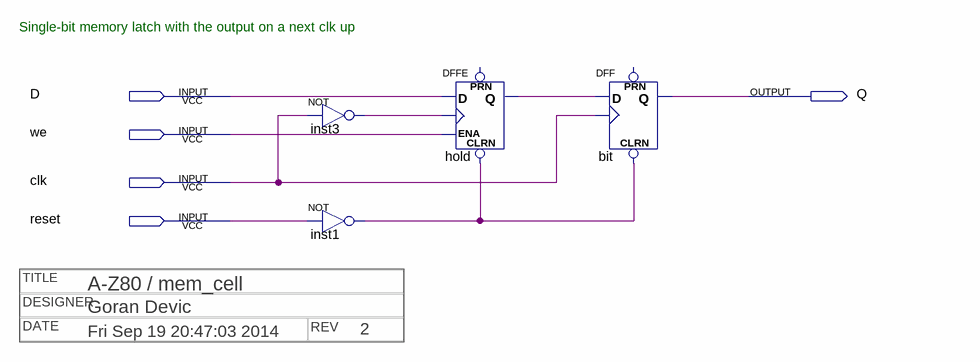
[diagram p0: schematic sheet]
// Quartus schematic mem_cell.bdf as structural Verilog: 4 symbols, 5 pins
// Title block: DATE: Fri Sep 19 20:47:03 2014; DESIGNER: Goran Devic; REV: 2; TITLE: A-Z80 / mem_cell
module mem_cell (
  input  D,
  input  we,
  input  clk,
  input  reset,
  output Q
);

  wire hold_q, inst1_out, inst3_out;

  not inst3 (inst3_out, clk);
  not inst1 (inst1_out, reset);
  DFFE hold (.CLRN(inst1_out), .D(D), .CLK(inst3_out), .ENA(we), .Q(hold_q));  // open: PRN
  DFF \bit  (.CLRN(inst1_out), .CLK(clk), .D(hold_q), .Q(Q));  // open: PRN

  // Notes on the sheet:
  //   Single-bit memory latch with the output on a next clk up
endmodule
